# Altium schematic sheet memory.SchDoc: Zillion - Z80 Single Board Computer
size A4; Author: Francesco Sacco; Revision: 0; ProjectName: Zillion - Z80 Single Board Computer
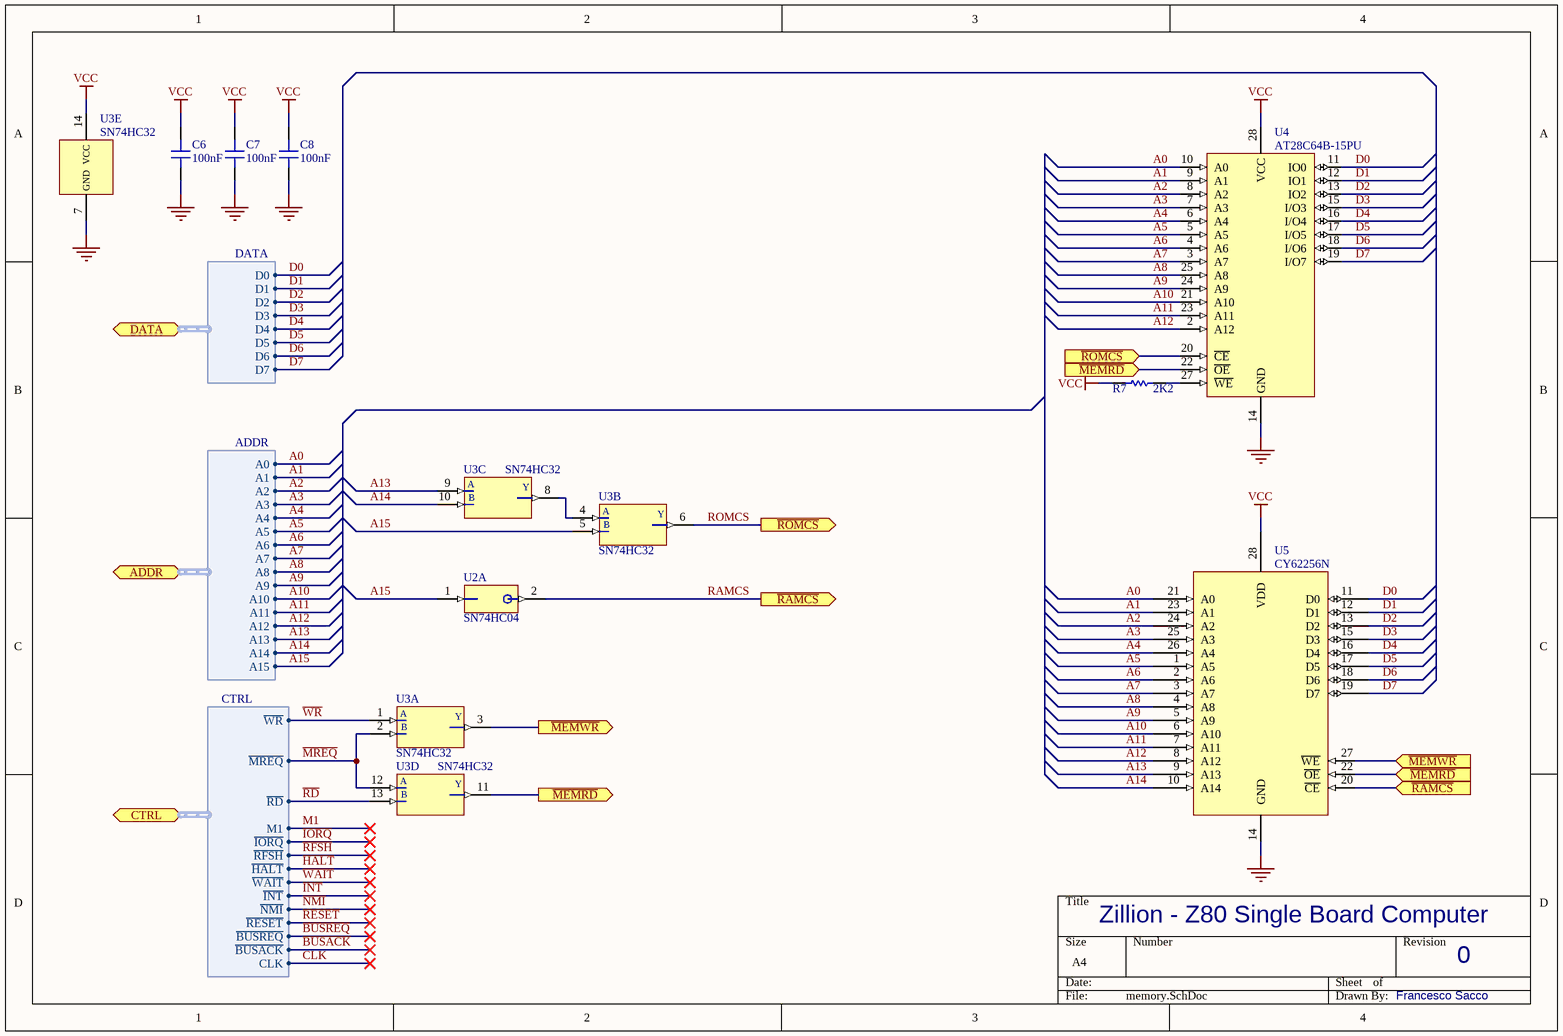
[diagram p0: memory.SchDoc]

## Parts
C6  100nF  [DiskCapacitor]
C7  100nF  [DiskCapacitor]
C8  100nF  [DiskCapacitor]
R7  2K2  [CR12]
U2  SN74HC04  [CDIP14]  (part A of 7)
U3  SN74HC32  [CDIP14]  (parts A,B,C,D,E of 5)
U4  AT28C64B-15PU  [PDIP28]
U5  CY62256N  [PDIP28]

## Ports
ADDR (harness ADDR), CTRL (harness CTRL), DATA (harness DATA), ~{MEMRD} (in), ~{MEMRD} (out), ~{MEMWR} (in), ~{MEMWR} (out), ~{RAMCS} (in), ~{RAMCS} (out), ~{ROMCS} (in), ~{ROMCS} (out)

## Harnesses
ADDR: A0, A1, A2, A3, A4, A5, A6, A7, A8, A9, A10, A11, A12, A13, A14, A15
DATA: D0, D1, D2, D3, D4, D5, D6, D7
CTRL: M1, ~{MREQ}, ~{IORQ}, ~{RD}, ~{WR}, ~{RFSH}, ~{HALT}, ~{WAIT}, ~{INT}, ~{NMI}, ~{RESET}, ~{BUSREQ}, ~{BUSACK}, CLK

## Nets
GND: C6.1 C7.1 C8.1 U3.7(GND) U4.14(GND) U5.14(GND)
VCC: C6.2 C7.2 C8.2 R7.2 U3.14(VCC) U4.28(VCC) U5.28(VDD)
A0: U4.10(A0) U5.21(A0) ; port ADDR.A0
A1: U4.9(A1) U5.23(A1) ; port ADDR.A1
A2: U4.8(A2) U5.24(A2) ; port ADDR.A2
A3: U4.7(A3) U5.25(A3) ; port ADDR.A3
A4: U4.6(A4) U5.26(A4) ; port ADDR.A4
A5: U4.5(A5) U5.1(A5) ; port ADDR.A5
A6: U4.4(A6) U5.2(A6) ; port ADDR.A6
A7: U4.3(A7) U5.3(A7) ; port ADDR.A7
A8: U4.25(A8) U5.4(A8) ; port ADDR.A8
A9: U4.24(A9) U5.5(A9) ; port ADDR.A9
A10: U4.21(A10) U5.6(A10) ; port ADDR.A10
A11: U4.23(A11) U5.7(A11) ; port ADDR.A11
A12: U4.2(A12) U5.8(A12) ; port ADDR.A12
A13: U3.9(A) U5.9(A13) ; port ADDR.A13
A14: U3.10(B) U5.10(A14) ; port ADDR.A14
A15: U2.1(A) U3.5(B) ; port ADDR.A15
~{BUSACK}: port CTRL.~{BUSACK}
~{BUSREQ}: port CTRL.~{BUSREQ}
CLK: port CTRL.CLK
D0: U4.11(IO0) U5.11(D0) ; port DATA.D0
D1: U4.12(IO1) U5.12(D1) ; port DATA.D1
D2: U4.13(IO2) U5.13(D2) ; port DATA.D2
D3: U4.15(I/O3) U5.15(D3) ; port DATA.D3
D4: U4.16(I/O4) U5.16(D4) ; port DATA.D4
D5: U4.17(I/O5) U5.17(D5) ; port DATA.D5
D6: U4.18(I/O6) U5.18(D6) ; port DATA.D6
D7: U4.19(I/O7) U5.19(D7) ; port DATA.D7
~{HALT}: port CTRL.~{HALT}
~{INT}: port CTRL.~{INT}
~{IORQ}: port CTRL.~{IORQ}
M1: port CTRL.M1
~{MEMRD}: U3.11(Y) U4.22(~{OE}) U5.22(~{OE}) ; port ~{MEMRD}
~{MEMWR}: U3.3(Y) U5.27(~{WE}) ; port ~{MEMWR}
~{MREQ}: U3.2(B) U3.12(A) ; port CTRL.~{MREQ}
~{NMI}: port CTRL.~{NMI}
~{RD}: U3.13(B) ; port CTRL.~{RD}
~{RESET}: port CTRL.~{RESET}
~{RFSH}: port CTRL.~{RFSH}
RAMCS: U2.2(Y) U5.20(~{CE}) ; port ~{RAMCS}
ROMCS: U3.6(Y) U4.20(~{CE}) ; port ~{ROMCS}
~{WAIT}: port CTRL.~{WAIT}
~{WR}: U3.1(A) ; port CTRL.~{WR}
NetR7_1: R7.1 U4.27(~{WE})
NetU3_4: U3.4(A) U3.8(Y)

## Library data of the parts
C6-C8 = Capacitor
R7 = Resistor
U2 = SN74HC04: Hex Inverters
U3 = SN74HC32: Quadruple 2-Input Positive-OR Gates
U4 = AT28C64B-15PU: 64K (8K x 8) Parallel EEPROM
U5 = CY62256N: 256-Kbit (32 K × 8) Static RAM